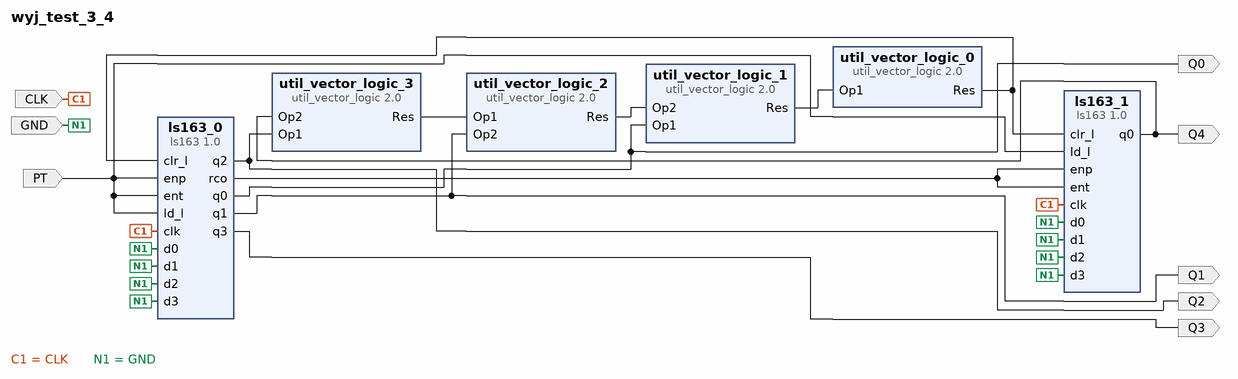
[diagram p0: block diagram of the top level]
# Vivado block design wyj_test_3_4, xc7a35tcsg324-1, Vivado 2024.2
create_bd_design wyj_test_3_4

create_bd_port -dir I CLK
create_bd_port -dir I PT
create_bd_port -dir I GND
create_bd_port -dir O Q0
create_bd_port -dir O Q1
create_bd_port -dir O Q2
create_bd_port -dir O Q3
create_bd_port -dir O Q4

create_bd_cell -type ip -vlnv xilinx.com:ip:util_vector_logic:2.0 util_vector_logic_0
set_property -dict {CONFIG.C_OPERATION not} [get_bd_cells util_vector_logic_0]
create_bd_cell -type ip -vlnv xilinx.com:ip:util_vector_logic:2.0 util_vector_logic_1
create_bd_cell -type ip -vlnv xilinx.com:ip:util_vector_logic:2.0 util_vector_logic_2
create_bd_cell -type ip -vlnv xilinx.com:ip:util_vector_logic:2.0 util_vector_logic_3
create_bd_cell -type ip -vlnv xilinx.com:uip:ls163:1.0 ls163_0
create_bd_cell -type ip -vlnv xilinx.com:uip:ls163:1.0 ls163_1

# ---- connections ----

connect_bd_net [get_bd_ports CLK] [get_bd_pins ls163_0/clk] [get_bd_pins ls163_1/clk]
connect_bd_net [get_bd_ports GND] \
  [get_bd_pins ls163_0/d0] [get_bd_pins ls163_0/d1] [get_bd_pins ls163_0/d2] [get_bd_pins ls163_0/d3] \
  [get_bd_pins ls163_1/d0] [get_bd_pins ls163_1/d3] [get_bd_pins ls163_1/d1] [get_bd_pins ls163_1/d2]
connect_bd_net [get_bd_pins util_vector_logic_0/Res] [get_bd_pins ls163_1/clr_l] [get_bd_pins ls163_0/clr_l]
connect_bd_net [get_bd_pins ls163_0/rco] [get_bd_pins ls163_1/ent] [get_bd_pins ls163_1/enp]
connect_bd_net [get_bd_ports PT] [get_bd_pins ls163_0/ld_l] [get_bd_pins ls163_0/enp] [get_bd_pins ls163_0/ent] [get_bd_pins ls163_1/ld_l]
connect_bd_net [get_bd_pins ls163_0/q0] [get_bd_ports Q0] [get_bd_pins util_vector_logic_1/Op1]
connect_bd_net [get_bd_pins ls163_0/q1] [get_bd_ports Q1] [get_bd_pins util_vector_logic_2/Op2]
connect_bd_net [get_bd_pins ls163_0/q2] [get_bd_ports Q2] [get_bd_pins util_vector_logic_3/Op1]
connect_bd_net [get_bd_pins ls163_0/q3] [get_bd_ports Q3]
connect_bd_net [get_bd_pins ls163_1/q0] [get_bd_ports Q4] [get_bd_pins util_vector_logic_3/Op2]
connect_bd_net [get_bd_pins util_vector_logic_1/Res] [get_bd_pins util_vector_logic_0/Op1]
connect_bd_net [get_bd_pins util_vector_logic_2/Res] [get_bd_pins util_vector_logic_1/Op2]
connect_bd_net [get_bd_pins util_vector_logic_3/Res] [get_bd_pins util_vector_logic_2/Op1]

validate_bd_design
save_bd_design
